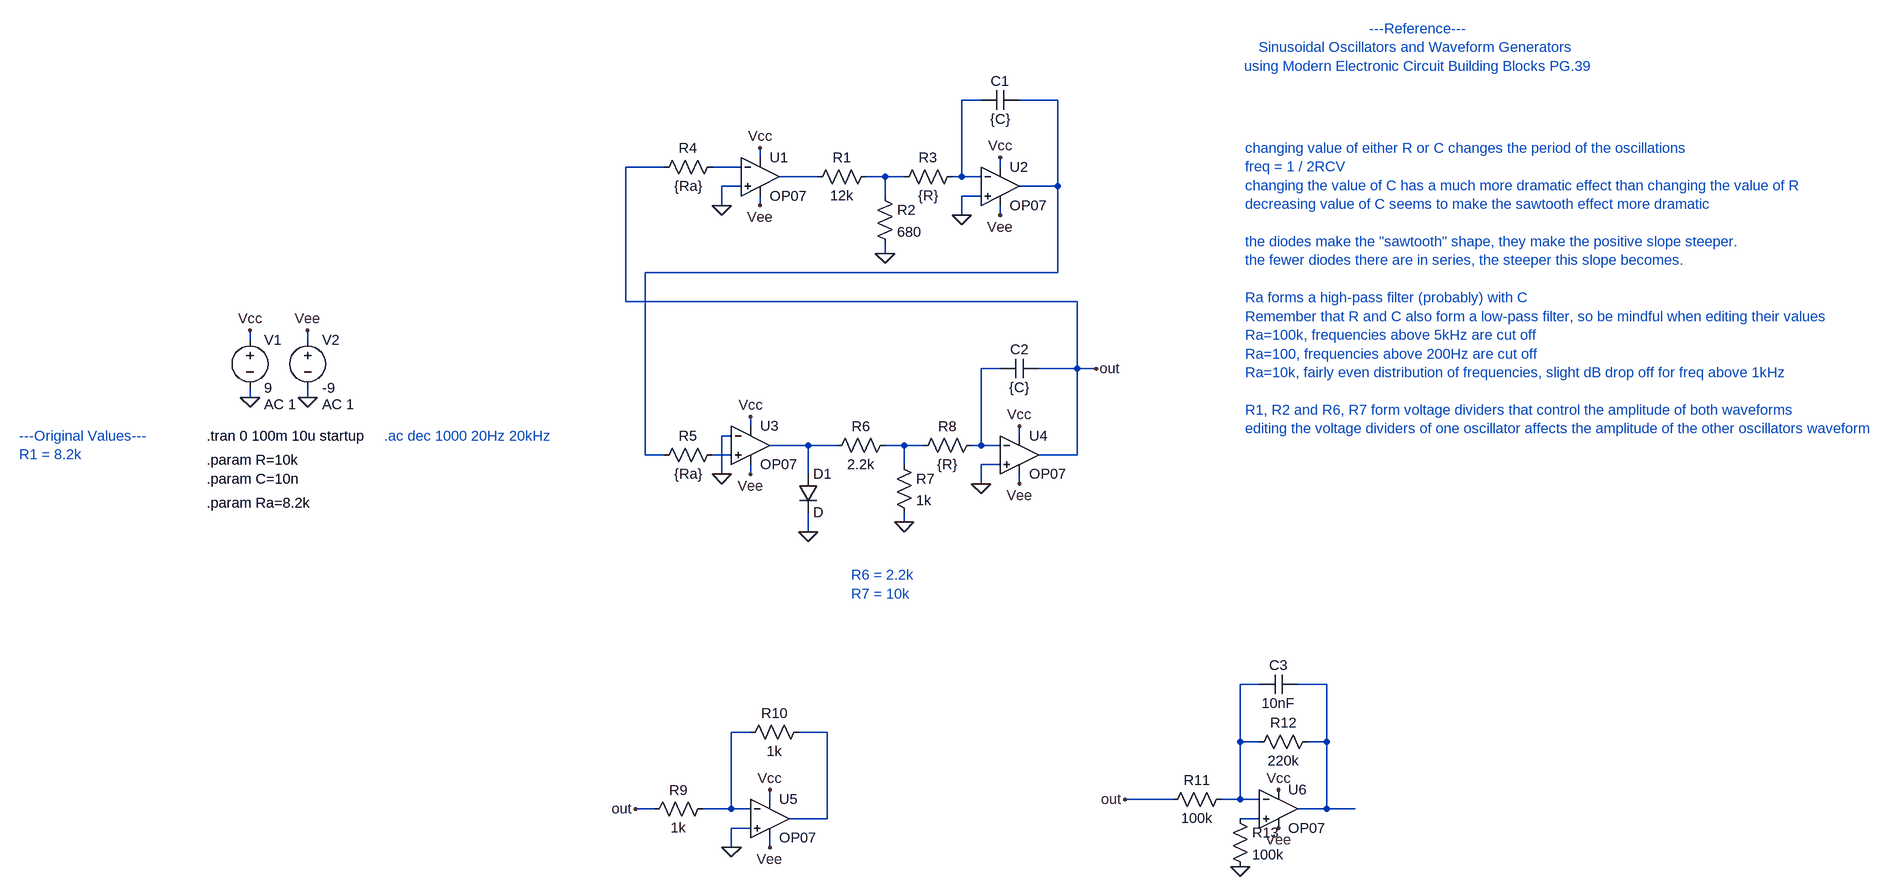
[diagram p0: schematic Sawtooth demo.asc]
Sawtooth demo.asc, the LTspice schematic file:
Version 4
SHEET 1 2544 1032
WIRE 944 -304 912 -304
WIRE 1072 -304 1008 -304
WIRE 576 -208 576 -224
WIRE 416 -192 352 -192
WIRE 544 -192 496 -192
WIRE 976 -192 976 -208
WIRE 672 -176 608 -176
WIRE 784 -176 752 -176
WIRE 816 -176 784 -176
WIRE 912 -176 912 -304
WIRE 912 -176 896 -176
WIRE 944 -176 912 -176
WIRE 544 -160 512 -160
WIRE 1072 -160 1072 -304
WIRE 1072 -160 1008 -160
WIRE 784 -144 784 -176
WIRE 944 -144 912 -144
WIRE 512 -128 512 -160
WIRE 576 -128 576 -144
WIRE 912 -112 912 -144
WIRE 976 -112 976 -128
WIRE 784 -48 784 -64
WIRE 1072 -16 1072 -160
WIRE 1072 -16 384 -16
WIRE 352 32 352 -192
WIRE 1104 32 352 32
WIRE -576 96 -576 80
WIRE -480 96 -480 80
WIRE 976 144 944 144
WIRE 1104 144 1104 32
WIRE 1104 144 1040 144
WIRE 1136 144 1104 144
WIRE -576 192 -576 176
WIRE -480 192 -480 176
WIRE 560 240 560 224
WIRE 528 256 512 256
WIRE 1008 256 1008 240
WIRE 656 272 592 272
WIRE 704 272 656 272
WIRE 816 272 784 272
WIRE 848 272 816 272
WIRE 944 272 944 144
WIRE 944 272 928 272
WIRE 976 272 944 272
WIRE 384 288 384 -16
WIRE 416 288 384 288
WIRE 528 288 496 288
WIRE 1104 288 1104 144
WIRE 1104 288 1040 288
WIRE 816 304 816 272
WIRE 976 304 944 304
WIRE 512 320 512 256
WIRE 560 320 560 304
WIRE 656 320 656 272
WIRE 944 336 944 304
WIRE 1008 336 1008 320
WIRE 816 400 816 384
WIRE 656 416 656 384
WIRE 1408 672 1376 672
WIRE 1520 672 1472 672
WIRE 560 752 528 752
WIRE 688 752 640 752
WIRE 1376 768 1376 672
WIRE 1408 768 1376 768
WIRE 1520 768 1520 672
WIRE 1520 768 1488 768
WIRE 592 864 592 848
WIRE 1264 864 1184 864
WIRE 1376 864 1376 768
WIRE 1376 864 1344 864
WIRE 1408 864 1376 864
WIRE 400 880 368 880
WIRE 528 880 528 752
WIRE 528 880 480 880
WIRE 560 880 528 880
WIRE 1520 880 1520 768
WIRE 1520 880 1472 880
WIRE 1568 880 1520 880
WIRE 688 896 688 752
WIRE 688 896 624 896
WIRE 1408 896 1376 896
WIRE 560 912 528 912
WIRE 528 944 528 912
WIRE 592 944 592 928
FLAG -480 192 0
FLAG -576 192 0
FLAG -576 80 Vcc
FLAG -480 80 Vee
FLAG 576 -224 Vcc
FLAG 576 -128 Vee
FLAG 976 -208 Vcc
FLAG 976 -112 Vee
FLAG 560 224 Vcc
FLAG 560 320 Vee
FLAG 1008 240 Vcc
FLAG 1008 336 Vee
FLAG 512 -128 0
FLAG 784 -48 0
FLAG 912 -112 0
FLAG 512 320 0
FLAG 816 400 0
FLAG 944 336 0
FLAG 656 416 0
FLAG 1136 144 out
FLAG 592 848 Vcc
FLAG 592 944 Vee
FLAG 528 944 0
FLAG 368 880 out
FLAG 1440 848 Vcc
FLAG 1440 912 Vee
FLAG 1376 976 0
FLAG 1184 864 out
SYMBOL voltage -576 80 R0
WINDOW 123 24 124 Left 2
WINDOW 39 0 0 Left 0
SYMATTR Value2 AC 1
SYMATTR InstName V1
SYMATTR Value 9
SYMBOL voltage -480 80 R0
WINDOW 123 24 124 Left 2
WINDOW 39 0 0 Left 0
SYMATTR Value2 AC 1
SYMATTR InstName V2
SYMATTR Value -9
SYMBOL OpAmps\\OP07 576 -240 R0
SYMATTR InstName U1
SYMBOL OpAmps\\OP07 976 -224 R0
SYMATTR InstName U2
SYMBOL OpAmps\\OP07 560 208 R0
SYMATTR InstName U3
SYMBOL OpAmps\\OP07 1008 224 R0
SYMATTR InstName U4
SYMBOL res 768 -192 R90
WINDOW 0 0 56 VBottom 2
WINDOW 3 32 56 VTop 2
SYMATTR InstName R1
SYMATTR Value 12k
SYMBOL res 768 -160 R0
SYMATTR InstName R2
SYMATTR Value 680
SYMBOL res 912 -192 R90
WINDOW 0 0 56 VBottom 2
WINDOW 3 32 56 VTop 2
SYMATTR InstName R3
SYMATTR Value {R}
SYMBOL cap 1008 -320 R90
WINDOW 0 0 32 VBottom 2
WINDOW 3 32 32 VTop 2
SYMATTR InstName C1
SYMATTR Value {C}
SYMBOL res 512 -208 R90
WINDOW 0 0 56 VBottom 2
WINDOW 3 32 56 VTop 2
SYMATTR InstName R4
SYMATTR Value {Ra}
SYMBOL res 512 272 R90
WINDOW 0 0 56 VBottom 2
WINDOW 3 32 56 VTop 2
SYMATTR InstName R5
SYMATTR Value {Ra}
SYMBOL diode 640 320 R0
SYMATTR InstName D1
SYMBOL res 800 256 R90
WINDOW 0 0 56 VBottom 2
WINDOW 3 32 56 VTop 2
SYMATTR InstName R6
SYMATTR Value 2.2k
SYMBOL res 800 288 R0
SYMATTR InstName R7
SYMATTR Value 1k
SYMBOL res 944 256 R90
WINDOW 0 0 56 VBottom 2
WINDOW 3 32 56 VTop 2
SYMATTR InstName R8
SYMATTR Value {R}
SYMBOL cap 1040 128 R90
WINDOW 0 0 32 VBottom 2
WINDOW 3 32 32 VTop 2
SYMATTR InstName C2
SYMATTR Value {C}
SYMBOL OpAmps\\OP07 592 832 R0
SYMATTR InstName U5
SYMBOL res 496 864 R90
WINDOW 0 0 56 VBottom 2
WINDOW 3 32 56 VTop 2
SYMATTR InstName R9
SYMATTR Value 1k
SYMBOL res 656 736 R90
WINDOW 0 0 56 VBottom 2
WINDOW 3 32 56 VTop 2
SYMATTR InstName R10
SYMATTR Value 1k
SYMBOL res 1360 848 R90
WINDOW 0 0 56 VBottom 2
WINDOW 3 32 56 VTop 2
SYMATTR InstName R11
SYMATTR Value 100k
SYMBOL OpAmps\\OP07 1440 816 R0
SYMATTR InstName U6
SYMBOL cap 1472 656 R90
WINDOW 0 0 32 VBottom 2
WINDOW 3 32 32 VTop 2
SYMATTR InstName C3
SYMATTR Value 10nF
SYMBOL res 1504 752 R90
WINDOW 0 0 56 VBottom 2
WINDOW 3 32 56 VTop 2
SYMATTR InstName R12
SYMATTR Value 220k
SYMBOL res 1360 880 R0
SYMATTR InstName R13
SYMATTR Value 100k
TEXT -648 256 Left 2 !.tran 0 100m 10u startup
TEXT 1384 -224 Left 2 ;changing value of either R or C changes the period of the oscillations\nfreq = 1 / 2RCV\nchanging the value of C has a much more dramatic effect than changing the value of R\ndecreasing value of C seems to make the sawtooth effect more dramatic\n \nthe diodes make the "sawtooth" shape, they make the positive slope steeper.\nthe fewer diodes there are in series, the steeper this slope becomes.\n \nRa forms a high-pass filter (probably) with C \nRemember that R and C also form a low-pass filter, so be mindful when editing their values\nRa=100k, frequencies above 5kHz are cut off\nRa=100, frequencies above 200Hz are cut off\nRa=10k, fairly even distribution of frequencies, slight dB drop off for freq above 1kHz\n \nR1, R2 and R6, R7 form voltage dividers that control the amplitude of both waveforms\nediting the voltage dividers of one oscillator affects the amplitude of the other oscillators waveform
TEXT -648 296 Left 2 !.param R=10k
TEXT -648 328 Left 2 !.param C=10n
TEXT -648 368 Left 2 !.param Ra=8.2k
TEXT -984 256 Left 2 ;---Original Values---\nR1 = 8.2k
TEXT -352 256 Left 2 ;.ac dec 1000 20Hz 20kHz
TEXT 728 488 Left 2 ;R6 = 2.2k\nR7 = 10k
TEXT 1672 -392 Center 2 ;---Reference---\nSinusoidal Oscillators and Waveform Generators \nusing Modern Electronic Circuit Building Blocks PG.39

The netlist it stands for:
* Sawtooth demo.asc
V1 Vcc 0 9 AC 1
V2 Vee 0 -9 AC 1
XU1 0 N003 Vcc Vee N004 LT1001  ; OP07, pins In+ In- V+ V- OUT
XU2 0 N001 Vcc Vee N002 LT1001  ; OP07, pins In+ In- V+ V- OUT
XU3 N009 0 Vcc Vee N007 LT1001  ; OP07, pins In+ In- V+ V- OUT
XU4 0 N006 Vcc Vee out LT1001  ; OP07, pins In+ In- V+ V- OUT
R1 N005 N004 12k
R2 N005 0 680
R3 N001 N005 {R}
C1 N002 N001 {C}
R4 N003 out {Ra}
R5 N009 N002 {Ra}
D1 N007 0 D
R6 N008 N007 2.2k
R7 N008 0 1k
R8 N006 N008 {R}
C2 out N006 {C}
XU5 0 N012 Vcc Vee N013 LT1001  ; OP07, pins In+ In- V+ V- OUT
R9 N012 out 1k
R10 N013 N012 1k
R11 N010 out 100k
XU6 N014 N010 Vcc Vee N011 LT1001  ; OP07, pins In+ In- V+ V- OUT
C3 N011 N010 10nF
R12 N011 N010 220k
R13 N014 0 100k
.model D D
.lib standard.dio
.tran 0 100m 10u startup
* changing value of either R or C changes the period of the oscillations
* freq = 1 / 2RCV
* changing the value of C has a much more dramatic effect than changing the value of R
* decreasing value of C seems to make the sawtooth effect more dramatic
* the diodes make the "sawtooth" shape, they make the positive slope steeper.
* the fewer diodes there are in series, the steeper this slope becomes.
* Ra forms a high-pass filter (probably) with C
* Remember that R and C also form a low-pass filter, so be mindful when editing their values
* Ra=100k, frequencies above 5kHz are cut off
* Ra=100, frequencies above 200Hz are cut off
* Ra=10k, fairly even distribution of frequencies, slight dB drop off for freq above 1kHz
* R1, R2 and R6, R7 form voltage dividers that control the amplitude of both waveforms
* editing the voltage dividers of one oscillator affects the amplitude of the other oscillators waveform
.param R=10k
.param C=10n
.param Ra=8.2k
* ---Original Values---
* R1 = 8.2k
* .ac dec 1000 20Hz 20kHz
* R6 = 2.2k
* R7 = 10k
* ---Reference---
* Sinusoidal Oscillators and Waveform Generators
* using Modern Electronic Circuit Building Blocks PG.39
.lib LTC.lib
.backanno
.end